# Altium schematic sheet ADC_Subsystem.SchDoc
size A; SheetNumber: 2; SheetTotal: 7
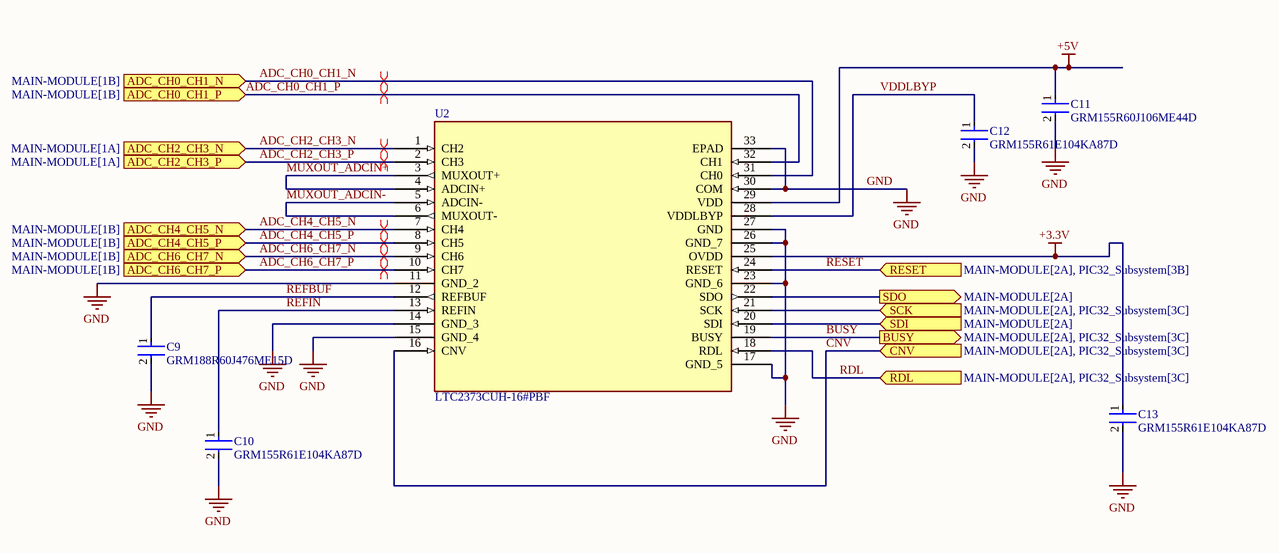
[diagram p0: ADC_Subsystem.SchDoc]

## Parts
C9  GRM188R60J476ME15D  [FP-GRM188-0_2-IPC_B]
C10  GRM155R61E104KA87D  [FP-GRM155-0_05-IPC_A]
C11  GRM155R60J106ME44D  [FP-GRM155-0_2-IPC_A]
C12  GRM155R61E104KA87D  [FP-GRM155-0_05-IPC_A]
C13  GRM155R61E104KA87D  [FP-GRM155-0_05-IPC_A]
U2  LTC2373CUH-16#PBF  [LTC_2373_Footprint]

## Ports
ADC_CH0_CH1_N (in, see MAIN-MODULE[1B]), ADC_CH0_CH1_P (in, see MAIN-MODULE[1B]), ADC_CH2_CH3_N (in, see MAIN-MODULE[1A]), ADC_CH2_CH3_P (in, see MAIN-MODULE[1A]), ADC_CH4_CH5_N (in, see MAIN-MODULE[1B]), ADC_CH4_CH5_P (in, see MAIN-MODULE[1B]), ADC_CH6_CH7_N (in, see MAIN-MODULE[1B]), ADC_CH6_CH7_P (in, see MAIN-MODULE[1B]), BUSY (out, see MAIN-MODULE[2A], PIC32_Subsystem[3C]), CNV (in, see MAIN-MODULE[2A], PIC32_Subsystem[3C]), RDL (in, see MAIN-MODULE[2A], PIC32_Subsystem[3C]), RESET (in, see MAIN-MODULE[2A], PIC32_Subsystem[3B]), SCK (in, see MAIN-MODULE[2A], PIC32_Subsystem[3C]), SDI (in, see MAIN-MODULE[2A]), SDO (out, see MAIN-MODULE[2A])

## Nets
+3.3V: C13.1 U2.25(OVDD)
+5V: C11.1 U2.29(VDD)
GND: C9.2 C10.2 C11.2 C12.2 C13.2 U2.11(GND_2) U2.14(GND_3) U2.15(GND_4) U2.17(GND_5) U2.23(GND_6) U2.26(GND_7) U2.27(GND) U2.30(COM) U2.33(EPAD)
ADC_CH0_CH1_N: U2.31(CH0) ; port ADC_CH0_CH1_N
ADC_CH0_CH1_P: U2.32(CH1) ; port ADC_CH0_CH1_P
ADC_CH2_CH3_N: U2.1(CH2) ; port ADC_CH2_CH3_N
ADC_CH2_CH3_P: U2.2(CH3) ; port ADC_CH2_CH3_P
ADC_CH4_CH5_N: U2.7(CH4) ; port ADC_CH4_CH5_N
ADC_CH4_CH5_P: U2.8(CH5) ; port ADC_CH4_CH5_P
ADC_CH6_CH7_N: U2.9(CH6) ; port ADC_CH6_CH7_N
ADC_CH6_CH7_P: U2.10(CH7) ; port ADC_CH6_CH7_P
BUSY: U2.19(BUSY) ; port BUSY
CNV: U2.16(CNV) ; port CNV
MUXOUT_ADCIN+: U2.3(MUXOUT+) U2.4(ADCIN+)
MUXOUT_ADCIN-: U2.5(ADCIN-) U2.6(MUXOUT-)
RDL: U2.18(RDL) ; port RDL
REFBUF: C9.1 U2.12(REFBUF)
REFIN: C10.1 U2.13(REFIN)
RESET: U2.24(RESET) ; port RESET
SCK: U2.21(SCK) ; port SCK
SDI: U2.20(SDI) ; port SDI
SDO: U2.22(SDO) ; port SDO
VDDLBYP: C12.1 U2.28(VDDLBYP)

## Layout directives
differential pair: ADC_CH0_CH1_N, ADC_CH0_CH1_P, ADC_CH2_CH3_N, ADC_CH2_CH3_P, ADC_CH4_CH5_N, ADC_CH4_CH5_P, ADC_CH6_CH7_N, ADC_CH6_CH7_P

## Library data of the parts
C9 = CMP-2000-05444-2: Chip Multilayer Ceramic Capacitors for General Purpose, 0603, 47uF, X5R, 15%, 20%, 6.3V; Voltage Rating (DC): 6.3V; Thickness: 0.039inch; Case Code (Imperial): 0603; Packaging: Tape and Reel; Capacitance: 47uF; Width: 0.031inch; Dielectric: X5R; Max Operating Temperature: 85°C; Mount: Surface Mount; Case Code (Metric): 1608; Length: 0.063inch; Voltage Rating: 6.3V; Tolerance: 20%; Case/Package: 0603; Min Operating Temperature: -55°C
C10 C12 C13 = CMP-2008-04580-2: CAP CER 0.1UF 25V X5R 0402; Lead/Base Style: Bayonet; Capacitance: 100nF; Tolerance: 10%; Material: Ceramic; REACH SVHC: No SVHC; Voltage: 25V; Voltage Rating: 25V; Length: 1mm; Min Operating Temperature: -55°C; Case/Package: 0402; Width: 0.5mm; Termination: Standard; Series: GRM; Mount: Surface Mount; Thickness: 0.022inch; Lead Free: Lead Free; Voltage Rating (DC): 25V; Package Quantity: 10000; Weight: 0.000388oz; Height: 0.5mm; Case Code (Metric): 1005; RoHS Compliant: Yes; Packaging: Cut Tape; Depth: 0.5mm; Case Code (Imperial): 0402; Radiation Hardening: No; Max Operating Temperature: 85°C; Dielectric: X5R
C11 = CMP-2000-05265-2: CAP CER 10UF 6.3V X5R 0402; Tolerance: 20%; Voltage Rating: 6.3V; Voltage Rating (DC): 6.3V; Voltage: 6.3V; Case Code (Metric): 1005; REACH SVHC: No SVHC; Min Operating Temperature: -55°C; Height: 0.5mm; Dielectric: X5R; Depth: 0.5mm; Thickness: 0.022inch; Packaging: Tape and Reel; Length: 1mm; Mount: Surface Mount; Package Quantity: 10000; Lead Free: Lead Free; Case/Package: 0402; Termination: SMD/SMT; Max Operating Temperature: 85°C; Case Code (Imperial): 0402; Series: GRM; Capacitance: 10uF; Width: 0.5mm; RoHS Compliant: Yes